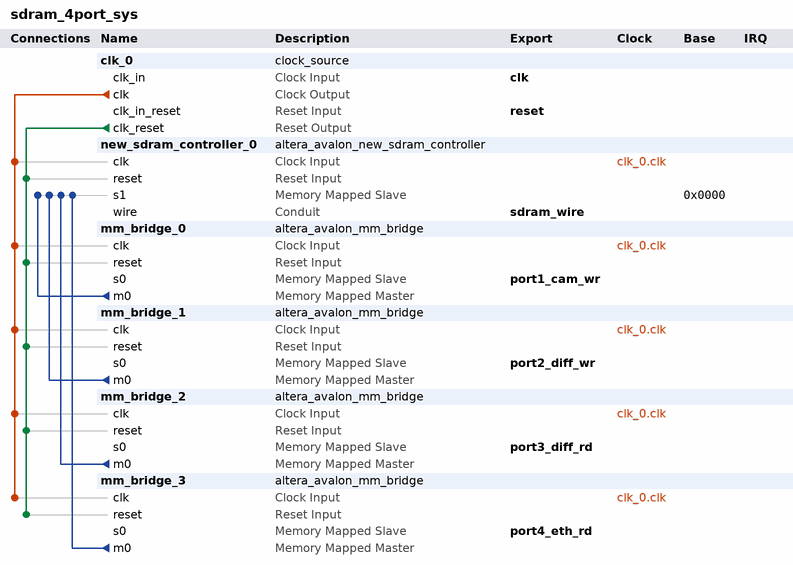
[diagram p0: system contents]
# Platform Designer (Qsys) system sdram_4port_sys, Cyclone IV E EP4CE10F17C8
# Parameters at their usual value, and those the tool derives, are not listed.
package require -exact qsys 20.1
create_system sdram_4port_sys
set_project_property DEVICE_FAMILY {Cyclone IV E}
set_project_property DEVICE EP4CE10F17C8

add_instance clk_0 clock_source 20.1
set_instance_parameter_value clk_0 clockFrequency 50000000

add_instance new_sdram_controller_0 altera_avalon_new_sdram_controller 20.1
set_instance_parameter_value new_sdram_controller_0 TAC 5.5
set_instance_parameter_value new_sdram_controller_0 TRCD 20.0
set_instance_parameter_value new_sdram_controller_0 TRP 20.0
set_instance_parameter_value new_sdram_controller_0 casLatency 3
set_instance_parameter_value new_sdram_controller_0 columnWidth 9
set_instance_parameter_value new_sdram_controller_0 dataWidth 16
set_instance_parameter_value new_sdram_controller_0 generateSimulationModel false
set_instance_parameter_value new_sdram_controller_0 model single_Micron_MT48LC4M32B2_7_chip
set_instance_parameter_value new_sdram_controller_0 numberOfBanks 4
set_instance_parameter_value new_sdram_controller_0 numberOfChipSelects 1
set_instance_parameter_value new_sdram_controller_0 powerUpDelay 100.0
set_instance_parameter_value new_sdram_controller_0 refreshPeriod 15.625
set_instance_parameter_value new_sdram_controller_0 rowWidth 13

add_instance mm_bridge_0 altera_avalon_mm_bridge 20.1
set_instance_parameter_value mm_bridge_0 ADDRESS_UNITS SYMBOLS
set_instance_parameter_value mm_bridge_0 ADDRESS_WIDTH 25
set_instance_parameter_value mm_bridge_0 DATA_WIDTH 16
set_instance_parameter_value mm_bridge_0 MAX_PENDING_RESPONSES 4
set_instance_parameter_value mm_bridge_0 USE_AUTO_ADDRESS_WIDTH 0

add_instance mm_bridge_1 altera_avalon_mm_bridge 20.1
set_instance_parameter_value mm_bridge_1 ADDRESS_UNITS SYMBOLS
set_instance_parameter_value mm_bridge_1 ADDRESS_WIDTH 25
set_instance_parameter_value mm_bridge_1 DATA_WIDTH 16
set_instance_parameter_value mm_bridge_1 MAX_PENDING_RESPONSES 4
set_instance_parameter_value mm_bridge_1 USE_AUTO_ADDRESS_WIDTH 0

add_instance mm_bridge_2 altera_avalon_mm_bridge 20.1
set_instance_parameter_value mm_bridge_2 ADDRESS_UNITS SYMBOLS
set_instance_parameter_value mm_bridge_2 ADDRESS_WIDTH 25
set_instance_parameter_value mm_bridge_2 DATA_WIDTH 16
set_instance_parameter_value mm_bridge_2 MAX_PENDING_RESPONSES 4
set_instance_parameter_value mm_bridge_2 USE_AUTO_ADDRESS_WIDTH 0

add_instance mm_bridge_3 altera_avalon_mm_bridge 20.1
set_instance_parameter_value mm_bridge_3 ADDRESS_UNITS SYMBOLS
set_instance_parameter_value mm_bridge_3 ADDRESS_WIDTH 25
set_instance_parameter_value mm_bridge_3 DATA_WIDTH 16
set_instance_parameter_value mm_bridge_3 MAX_PENDING_RESPONSES 4
set_instance_parameter_value mm_bridge_3 USE_AUTO_ADDRESS_WIDTH 0

# connections
add_connection clk_0.clk mm_bridge_0.clk clock
add_connection clk_0.clk mm_bridge_1.clk clock
add_connection clk_0.clk mm_bridge_2.clk clock
add_connection clk_0.clk mm_bridge_3.clk clock
add_connection clk_0.clk new_sdram_controller_0.clk clock
add_connection clk_0.clk_reset mm_bridge_0.reset reset
add_connection clk_0.clk_reset mm_bridge_1.reset reset
add_connection clk_0.clk_reset mm_bridge_2.reset reset
add_connection clk_0.clk_reset mm_bridge_3.reset reset
add_connection clk_0.clk_reset new_sdram_controller_0.reset reset
add_connection mm_bridge_0.m0 new_sdram_controller_0.s1 avalon
set_connection_parameter_value mm_bridge_0.m0/new_sdram_controller_0.s1 baseAddress 0x0000
add_connection mm_bridge_1.m0 new_sdram_controller_0.s1 avalon
set_connection_parameter_value mm_bridge_1.m0/new_sdram_controller_0.s1 baseAddress 0x0000
add_connection mm_bridge_2.m0 new_sdram_controller_0.s1 avalon
set_connection_parameter_value mm_bridge_2.m0/new_sdram_controller_0.s1 baseAddress 0x0000
add_connection mm_bridge_3.m0 new_sdram_controller_0.s1 avalon
set_connection_parameter_value mm_bridge_3.m0/new_sdram_controller_0.s1 baseAddress 0x0000

# exported interfaces
add_interface clk clock sink
set_interface_property clk EXPORT_OF clk_0.clk_in
add_interface port1_cam_wr avalon slave
set_interface_property port1_cam_wr EXPORT_OF mm_bridge_0.s0
add_interface port2_diff_wr avalon slave
set_interface_property port2_diff_wr EXPORT_OF mm_bridge_1.s0
add_interface port3_diff_rd avalon slave
set_interface_property port3_diff_rd EXPORT_OF mm_bridge_2.s0
add_interface port4_eth_rd avalon slave
set_interface_property port4_eth_rd EXPORT_OF mm_bridge_3.s0
add_interface reset reset sink
set_interface_property reset EXPORT_OF clk_0.clk_in_reset
add_interface sdram_wire conduit end
set_interface_property sdram_wire EXPORT_OF new_sdram_controller_0.wire

set_interconnect_requirement {$system} qsys_mm.clockCrossingAdapter HANDSHAKE
set_interconnect_requirement {$system} qsys_mm.enableEccProtection FALSE
set_interconnect_requirement {$system} qsys_mm.insertDefaultSlave FALSE
set_interconnect_requirement {$system} qsys_mm.maxAdditionalLatency 1

save_system sdram_4port_sys.qsys
